# Altium schematic sheet Sine.SchDoc
size A
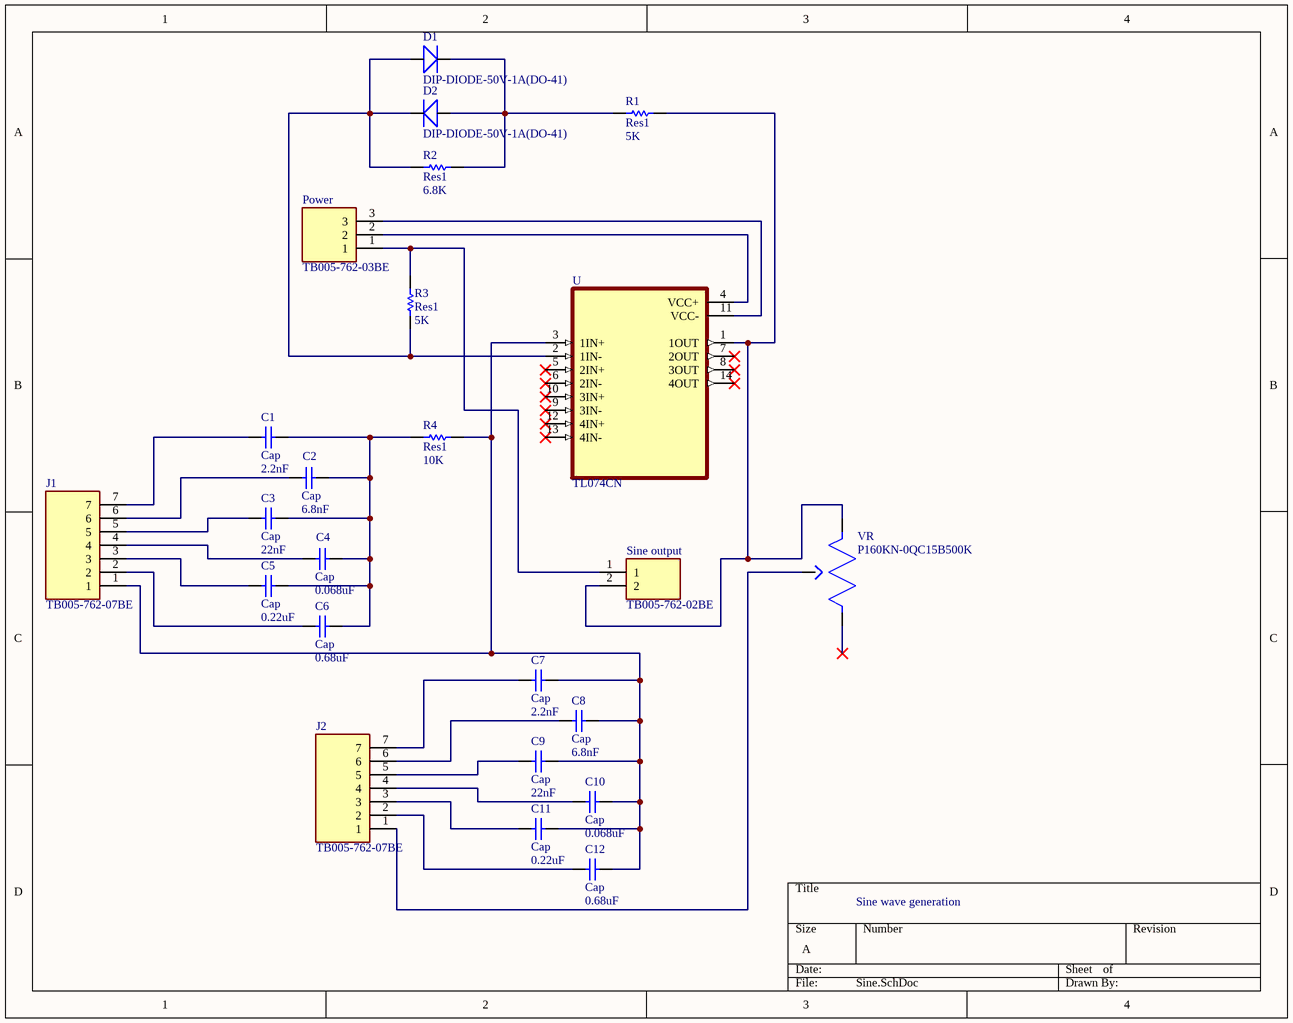
[diagram p0: Sine.SchDoc]

## Parts
C1  Cap  value 2.2nF  [RAD-0.3]
C2  Cap  value 6.8nF  [RAD-0.3]
C3  Cap  value 22nF  [RAD-0.3]
C4  Cap  value 0.068uF  [RAD-0.3]
C5  Cap  value 0.22uF  [RAD-0.3]
C6  Cap  value 0.68uF  [RAD-0.3]
C7  Cap  value 2.2nF  [RAD-0.3]
C8  Cap  value 6.8nF  [RAD-0.3]
C9  Cap  value 22nF  [RAD-0.3]
C10  Cap  value 0.068uF  [RAD-0.3]
C11  Cap  value 0.22uF  [RAD-0.3]
C12  Cap  value 0.68uF  [RAD-0.3]
D1  DIP-DIODE-50V-1A(DO-41)  [DO-41]
D2  DIP-DIODE-50V-1A(DO-41)  [DO-41]
J1  TB005-762-07BE  [CUI_TB005-762-07BE]
J2  TB005-762-07BE  [CUI_TB005-762-07BE]
Power  TB005-762-03BE  [CUI_TB005-762-03BE]
R1  Res1  value 5K  [AXIAL-0.3]
R2  Res1  value 6.8K  [AXIAL-0.3]
R3  Res1  value 5K  [AXIAL-0.3]
R4  Res1  value 10K  [AXIAL-0.3]
Sine_output  TB005-762-02BE  [CUI_TB005-762-02BE]
U  TL074CN  [DIP794W45P254L1969H508Q14]
VR  P160KN-0QC15B500K  [P160]

## Nets
NetC1_1: C1.1 J1.7
NetC1_2: C1.2 C2.2 C3.2 C4.2 C5.2 C6.2 R4.1
NetC2_1: C2.1 J1.6
NetC3_1: C3.1 J1.5
NetC4_1: C4.1 J1.4
NetC5_1: C5.1 J1.3
NetC6_1: C6.1 J1.2
NetC7_1: C7.1 J2.7
NetC7_2: C7.2 C8.2 C9.2 C10.2 C11.2 C12.2 J1.1 R4.2 U.3(1IN+)
NetC8_1: C8.1 J2.6
NetC9_1: C9.1 J2.5
NetC10_1: C10.1 J2.4
NetC11_1: C11.1 J2.3
NetC12_1: C12.1 J2.2
NetD1_1: D1.1(POS) D2.2(NEG) R2.1 R3.1 U.2(1IN-)
NetD1_2: D1.2(NEG) D2.1(POS) R1.1 R2.2
NetJ2_1: J2.1 VR.2
NetPower_1: Power.1 R3.2 Sine_output.1
NetPower_2: Power.2 U.4(VCC+)
NetPower_3: Power.3 U.11(VCC-)
NetR1_2: R1.2 Sine_output.2 U.1(1OUT) VR.1

Not connected (* = marked no-connect by the designer): U 5(2IN+)* 6(2IN-)* 7(2OUT)* 8(3OUT)* 9(3IN-)* 10(3IN+)* 12(4IN+)* 13(4IN-)* 14(4OUT)*; VR 3*

## Notes on the sheet
- Sine wave generation

## Library data of the parts
C1-C12 = Cap: Capacitor; Published: 8-Jun-2000; LatestRevisionDate: 17-Jul-2002; LatestRevisionNote: Re-released for DXP Platform.; PackageReference: RAD-0.3; Publisher: Altium Limited; PackageDescription: Radial Cap, Thru-Hole; 2 Leads; 0.3 in Pin Spacing
D1 D2 = DIP-DIODE-50V-1A(DO-41): Diode Standard 50V 1A Through Hole DO-41; MF: Comchip Technology; MP: 1N4001-G; Package: DO-41 Comchip; Value: *; Price: None; SnapEDA_Link: https://www.snapeda.com/parts/1N4001-G/Comchip%20Technology/view-part/106354/?ref=snap; Availability: Unavailable
J1 J2 = TB005-762-07BE: 2~24 Poles, Screw Type, Horizontal, 7.62 Pitch, 26~10 (AWG), Terminal Block Connector; MF: CUI Devices; MP: TB005-762-07BE; Value: *; Availability: Unavailable; Package: None; Price: None; SnapEDA_Link: https://www.snapeda.com/parts/TB005-762-07BE/CUI%20Devices/view-part/3591007/?ref=snap; CUI_purchase_URL: https://www.cuidevices.com/product/interconnect/connectors/terminal-blocks/tb005-762-series?utm_source=snapeda.com&utm_medium=referral&utm_campaign=snapedaBOM; Check_prices: https://www.snapeda.com/parts/TB005-762-07BE/CUI%20Devices/view-part/3591007/?ref=eda
Power = TB005-762-03BE: 2~24 Poles, Screw Type, Horizontal, 7.62 Pitch, 26~10 _AWG_, Terminal Block Connector; MF: CUI Devices; CUI_purchase_URL: https://www.cuidevices.com/product/interconnect/connectors/terminal-blocks/tb005-762-series?utm_source=snapeda.com&utm_medium=referral&utm_campaign=snapedaBOM; MP: TB005-762-03BE; SnapEDA_Link: https://www.snapeda.com/parts/TB005-762-03BE/CUI%20Devices/view-part/3590987/?ref=snap; Price: None; Package: None; Availability: Unavailable; Value: *
R1-R4 = Res1: Resistor; Published: 8-Jun-2000; LatestRevisionDate: 17-Jul-2002; LatestRevisionNote: Re-released for DXP Platform.; PackageReference: AXIAL-0.3; Publisher: Altium Limited; PackageDescription: Axial Device, Thru-Hole; 2 Leads; 0.3 in Pin Spacing
Sine_output = TB005-762-02BE: 2~24 Poles, Screw Type, Horizontal, 7.62 Pitch, 26~10 _AWG_, Terminal Block Connector; MF: CUI Devices; SnapEDA_Link: https://www.snapeda.com/parts/TB005-762-02BE/CUI%20Devices/view-part/3590982/?ref=snap; Price: None; Availability: Unavailable; Package: None; MP: TB005-762-02BE; Value: *
U = TL074CN: Quad Low-Noise JFET-Input General-Purpose Operational Amplifier 14-PDIP 0 to 70; MF: Texas Instruments; SnapEDA_Link: https://www.snapeda.com/parts/TL074CN/Texas%20Instruments/view-part/4796371/?ref=snap; Price: None; Mouser-Purchase-URL: https://snapeda.com/shop?store=Mouser&id=4796371; Package: PDIP-14 Texas Instruments; Availability: Good; Texas_Instruments-Purchase-URL: https://snapeda.com/shop?store=Texas+Instruments&id=4796371; MP: TL074CN; DigiKey-Purchase-URL: https://snapeda.com/shop?store=DigiKey&id=4796371; Value: *
VR = P160KN-0QC15B500K: 500k Ohm 1 Gang Linear Panel Mount Potentiometer None 1 Turn Conductive Plastic 0.2W, 1/5W PC Pins; MF: TT Electronics/BI; Value: *; Digi-Key_Part_Number: 987-1304-ND; Package: None; Digi-Key_Purchase_URL: https://www.digikey.cz/product-detail/en/tt-electronics-bi/P160KN-0QC15B500K/987-1304-ND/2408881?utm_source=snapeda&utm_medium=aggregator&utm_campaign=symbol; MP: P160KN-0QC15B500K; SnapEDA_Link: https://www.snapeda.com/parts/P160KN-0QC15B500K/TT%20Electronics/BI/view-part/903272/?ref=snap